# Altium schematic sheet Battery Fuel Gauge.SchDoc
size A; SheetNumber: 4; SheetTotal: 4
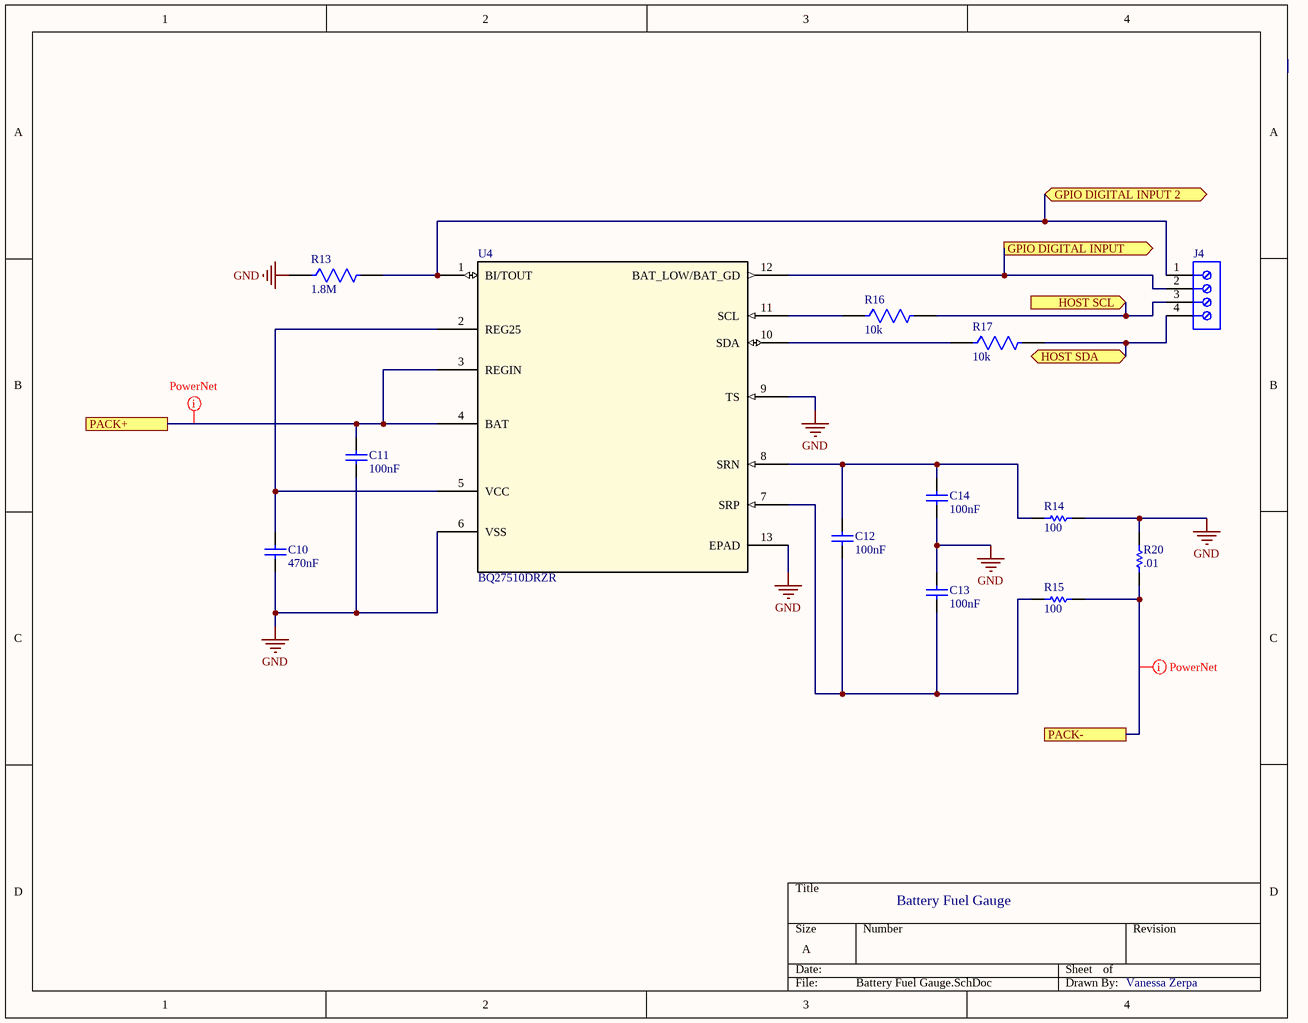
[diagram p0: Battery Fuel Gauge.SchDoc]

## Parts
C10  470nF  [CAPC2013X140X50ML20T25]
C11  100nF  [CAPC2013X94X50NL20T25]
C12  100nF  [CAPC2013X94X50NL20T25]
C13  100nF  [CAPC2013X94X50NL20T25]
C14  100nF  [CAPC2013X94X50NL20T25]
J4  Screw top terminal  [691709710304]  (value not drawn)
R13  1.8M  [FP-CRCW0805-e3-MFG]
R14  100  [RESC2013X60X40ML20T25]
R15  100  [RESC2013X60X40ML20T25]
R16  10k  [FP-CR0805-IPC_B]
R17  10k  [FP-CR0805-IPC_B]
R20  .01  [RESC2013X75X55NL20T20]
U4  BQ27510DRZR  [DRZ12_1P95X2P45]

## Ports
GPIO DIGITAL INPUT 2 (bidir), GPIO DIGITAL INPUT (out), HOST SCL (in), HOST SDA (bidir), PACK+, PACK-

## Nets
GND: C10.1 C11.1 C13.2 C14.1 R13.1 R14.2 R20.2 U4.6(VSS) U4.9(TS) U4.13(EPAD)
GPIO DIGITAL INPUT: J4.2 U4.12(BAT_LOW/BAT_GD) ; port GPIO DIGITAL INPUT
GPIO DIGITAL INPUT 2: J4.1 R13.2 U4.1(BI/TOUT) ; port GPIO DIGITAL INPUT 2
HOST SCL: J4.3 R16.2 ; port HOST SCL
HOST SDA: J4.4 R17.2 ; port HOST SDA
PACK+: C11.2 U4.3(REGIN) U4.4(BAT) ; port PACK+
PACK-: R15.2 R20.1 ; port PACK-
NetC10_2: C10.2 U4.2(REG25) U4.5(VCC)
NetC12_1: C12.1 C13.1 R15.1 U4.7(SRP)
NetC12_2: C12.2 C14.2 R14.1 U4.8(SRN)
NetR16_1: R16.1 U4.11(SCL)
NetR17_1: R17.1 U4.10(SDA)

## Layout directives
net class PowerNets: PACK+, PACK-

## Notes on the sheet
- Battery Fuel Gauge
- Vanessa Zerpa

## Library data of the parts
C10 = CMP-2007-04613-1: Manufacturer: AVX Interconnect / Elco; Part Number: 08053D474KAT2A
C11-C14 = CMP-1036-04419-2: Manufacturer: AVX Interconnect / Elco; Part Number: 08055C104KAT4A
J4 = CMP-1502-03337-1: Serie 7097 - 5.00 mm Horizontal Entry SMT with Pressure Clamp WR-TBL, 4 pin; Manufacturer: Wurth Elektronik; Pin Number: 4; Pitch: 5.00mm; Mounting Technology: SMT; Package Reference: 691709710304; Datasheet URL: http://katalog.we-online.de/em/datasheet/6917097103xx.pdf; Packaging: TapeandReelwithCap; Part Number: 691709710304; Operating Temperature: -45to130degC; Publisher: WurthElektronik; Manufacturer URL: http://www.we-online.de
R13 = CMP-2001-03646-2: RES Thick Film, 1.8MΩ, 5%, 0.125W, 200ppm/°C, 0805; Voltage Rating: 150V; Max Power Dissipation: 125mW; Resistance: 1.8MR; Features: Automotive AEC-Q200; Package Quantity: 1; Contact Plating: Tin; Case Code (Imperial): 0805; Case/Package: 0805; Termination: SMD/SMT; Lead Free: Lead Free; Tolerance: 5%; Voltage Rating (DC): 150V; Weight: 0.000194oz; Depth: 1.25mm; Power Rating: 125mW; Military Standard: Not; Packaging: Tape and Reel; Length: 2mm; Height: 0.02inch; Number of Terminations: 2; Radiation Hardening: No; Composition: Thick Film; Case Code (Metric): 2012; Temperature Coefficient: 200ppm/°C; Max Operating Temperature: 155°C; Min Operating Temperature: -55°C; Width: 1.25mm
R14 R15 = CMP-2001-00580-1: Manufacturer: Panasonic; Part Number: ERA6AEB101V
R16 R17 = CMP-07231-003873-1: Thick Film Chip Resistors 0805 10kΩ 0.125W 5% 200ppm/°C; Resistance: 10kR; Power Rating: 125mW; Voltage Rating (DC): 100V; Voltage Rating: 150V; Width: 1.25mm; Composition: Thick Film; Packaging: Tape and Reel; Number of Terminations: 2; Min Operating Temperature: -55°C; Height: 0.5mm; Temperature Coefficient: 200ppm/°C; Features: Moisture Resistant; Termination: SMD/SMT; Case Code (Imperial): 0805; Package Quantity: 1; Radiation Hardening: No; Military Standard: Not; Thickness: 508um; Depth: 1.25mm; Tolerance: 5%; Contact Plating: Tin; Number of Pins: 2; Length: 2mm; Max Power Dissipation: 125mW; Mount: Surface Mount; Case Code (Metric): 2012; Case/Package: 0805; REACH SVHC: No SVHC; Max Operating Temperature: 155°C
R20 = CMP-2001-04363-1: Part Number: ERJ-6BWFR010V; Manufacturer: Panasonic
U4 = BQ27510DRZR: No Description Available; Mfr_Name: Texas Instruments; Copyright: Copyright (C) 2021 Ultra Librarian. All rights reserved.; Manufacturer_Part_Number: BQ27510DRZR; RefDes: RefDes; Type: DEV